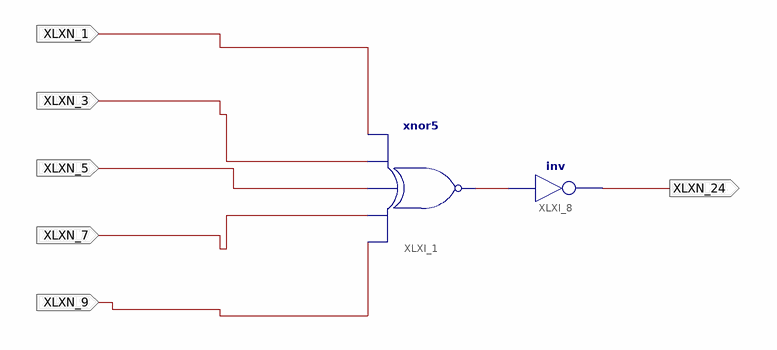
[diagram p0: schematic sheet 1]
// Xilinx ISE schematic lab5__3.sch (spartan6) as structural Verilog: 2 symbols, 6 ports
module lab5__3 (
  input  XLXN_1,
  input  XLXN_3,
  input  XLXN_7,
  input  XLXN_9,
  input  XLXN_5,
  output XLXN_24
);

  wire XLXN_23;

  xnor XLXI_1 (XLXN_23, XLXN_9, XLXN_7, XLXN_5, XLXN_3, XLXN_1);
  not XLXI_8 (XLXN_24, XLXN_23);
endmodule
